# Altium schematic sheet Cover.SchDoc
size OrCAD C
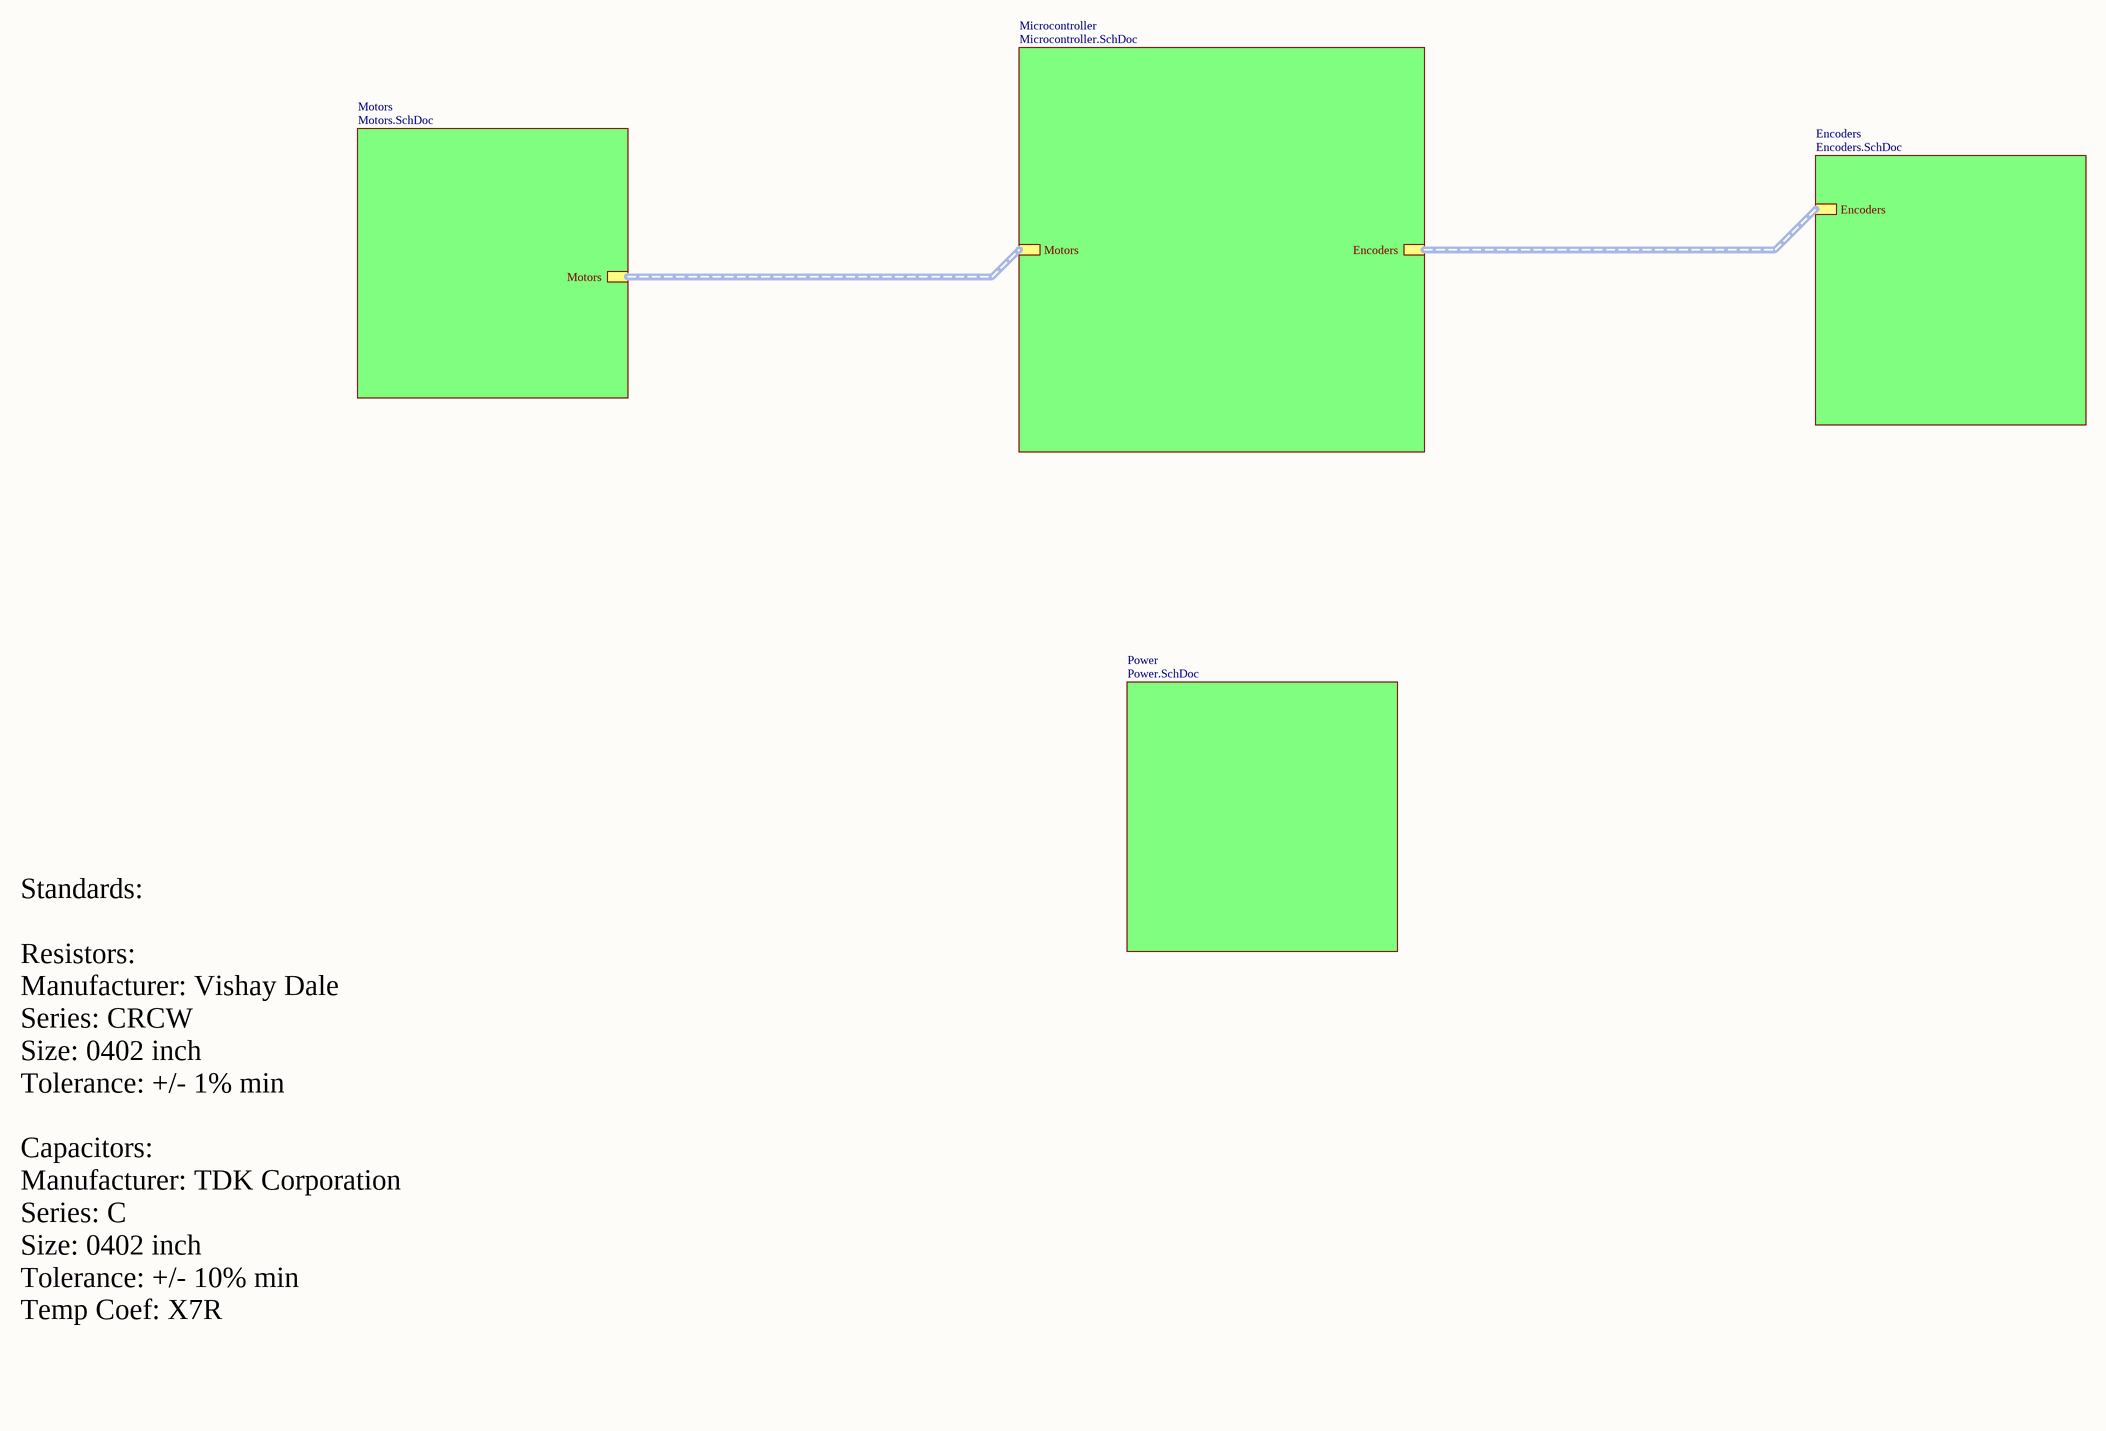
[diagram p0: Cover.SchDoc]

## Sub-sheets
Encoders = Encoders.SchDoc: Encoders (harness Encoders)
Microcontroller = Microcontroller.SchDoc: Motors (harness Motors), Encoders (harness Encoders)
Motors = Motors.SchDoc: Motors (harness Motors)
Power = Power.SchDoc: no entries

## Buses and harness runs
harness sheet Encoders/Encoders = sheet Microcontroller/Encoders
harness sheet Microcontroller/Motors = sheet Motors/Motors

## Notes on the sheet
- Standards:
  Resistors:
  Manufacturer: Vishay Dale
  Series: CRCW
  Size: 0402 inch
  Tolerance: +/- 1% min
  Capacitors:
  Manufacturer: TDK Corporation
  Series: C
  Size: 0402 inch
  Tolerance: +/- 10% min
  Temp Coef: X7R